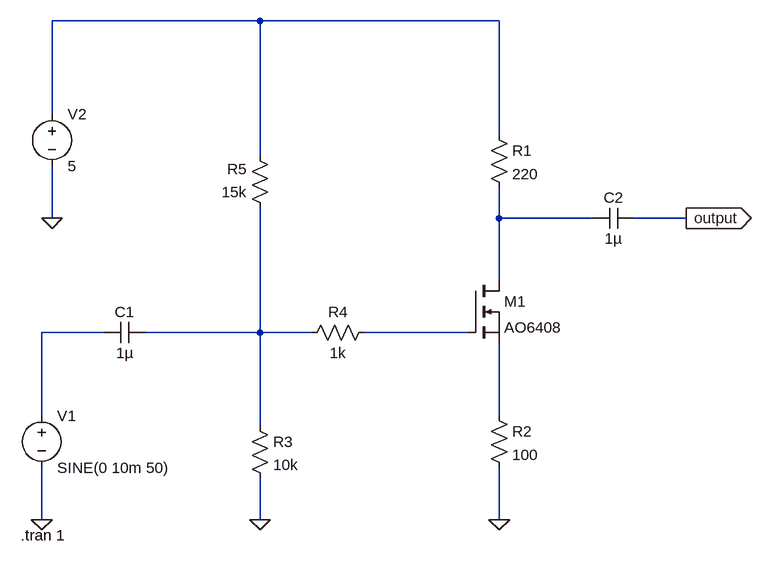
[diagram p0: schematic ortak_source_kuvvetlendirici.asc]
ortak_source_kuvvetlendirici.asc, the LTspice schematic file:
Version 4
SHEET 1 880 680
WIRE -64 -304 -384 -304
WIRE 304 -304 -64 -304
WIRE -384 -160 -384 -304
WIRE 304 -128 304 -304
WIRE -64 -96 -64 -304
WIRE -384 0 -384 -80
WIRE 304 0 304 -48
WIRE 448 0 304 0
WIRE 592 0 512 0
WIRE 304 96 304 0
WIRE -304 176 -400 176
WIRE -64 176 -64 -16
WIRE -64 176 -240 176
WIRE 16 176 -64 176
WIRE 256 176 96 176
WIRE -400 304 -400 176
WIRE 304 304 304 192
WIRE -64 320 -64 176
WIRE -400 464 -400 384
WIRE -64 464 -64 400
WIRE 304 464 304 384
FLAG -64 464 0
FLAG 304 464 0
FLAG -400 464 0
FLAG -384 0 0
FLAG 592 0 output
IOPIN 592 0 Out
SYMBOL nmos 256 96 R0
SYMATTR InstName M1
SYMATTR Value AO6408
SYMBOL res 288 -144 R0
SYMATTR InstName R1
SYMATTR Value 220
SYMBOL res 288 288 R0
SYMATTR InstName R2
SYMATTR Value 100
SYMBOL res -80 304 R0
SYMATTR InstName R3
SYMATTR Value 10k
SYMBOL res 112 160 R90
WINDOW 0 0 56 VBottom 2
WINDOW 3 32 56 VTop 2
SYMATTR InstName R4
SYMATTR Value 1k
SYMBOL res -48 0 R180
WINDOW 0 36 76 Left 2
WINDOW 3 36 40 Left 2
SYMATTR InstName R5
SYMATTR Value 15k
SYMBOL cap -240 160 R90
WINDOW 0 0 32 VBottom 2
WINDOW 3 32 32 VTop 2
SYMATTR InstName C1
SYMATTR Value 1µ
SYMBOL voltage -400 288 R0
WINDOW 123 0 0 Left 0
WINDOW 39 0 0 Left 0
SYMATTR InstName V1
SYMATTR Value SINE(0 10m 50)
SYMBOL voltage -384 -176 R0
WINDOW 123 0 0 Left 0
WINDOW 39 0 0 Left 0
SYMATTR InstName V2
SYMATTR Value 5
SYMBOL cap 512 -16 R90
WINDOW 0 0 32 VBottom 2
WINDOW 3 32 32 VTop 2
SYMATTR InstName C2
SYMATTR Value 1µ
TEXT -432 488 Left 2 !.tran 1

The netlist it stands for:
* ortak_source_kuvvetlendirici.asc
M1 N002 N005 N006 N006 AO6408
R1 N001 N002 220
R2 N006 0 100
R3 N004 0 10k
R4 N005 N004 1k
R5 N004 N001 15k
C1 N004 N003 1µ
V1 N003 0 SINE(0 10m 50)
V2 N001 0 5
C2 output N002 1µ
.model NMOS NMOS
.model PMOS PMOS
.lib standard.mos
.tran 1
.backanno
.end